# Altium project GPS-RCB-F9T.PrjPcb
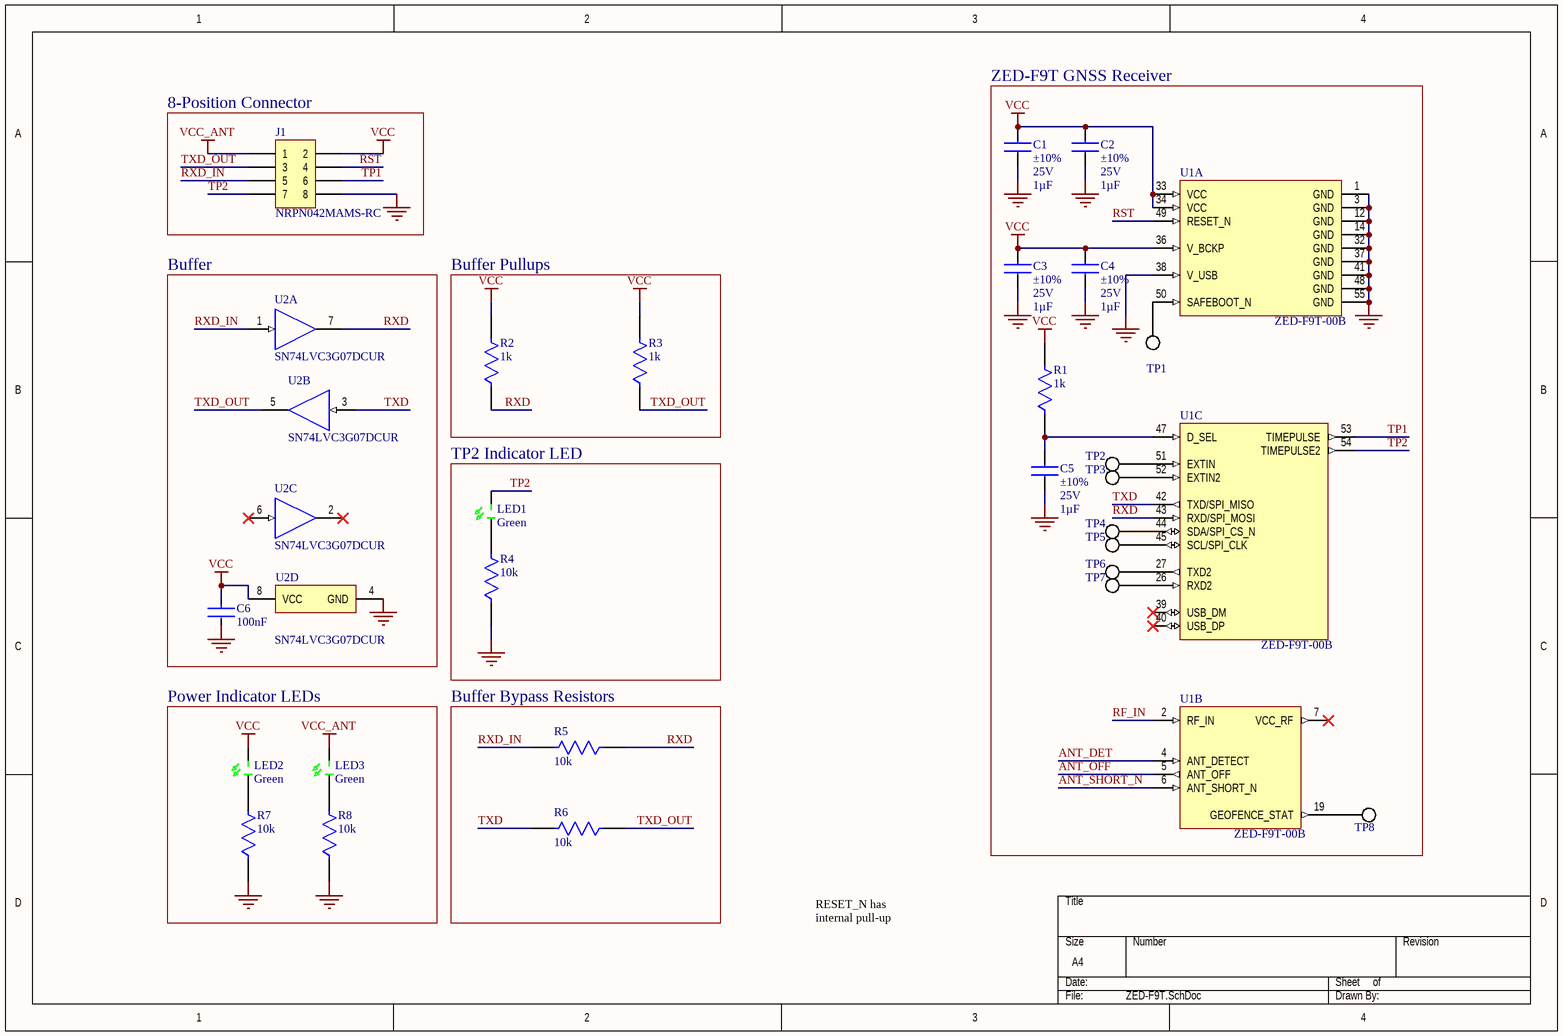
[diagram p0: ZED-F9T.SchDoc]
revision: rev.1.0; TENSH: ТЕНШ.468157.03.00.000; company: SHIWA NETWORK
1 sheet, 28 parts. Net scope: global (net labels, ports and power ports of the same name join across sheets).
Board file: GPS-RCB-F9T.PcbDoc

## Sheet ZED-F9T.SchDoc
size A4; sch_PageDescription: sch_PageDescription; sch_PageTitle: sch_PageTitle; Organization: ORGANIZATION; Address1: ADDRESS 1; Address2: ADDRESS 2; Address3: ADDRESS 3; Address4: ADDRESS 4; Revision: -; SheetNumber: 2; SheetTotal: 3; ENG_APP_DATE: --/--/--; DSN_APP_DATE: --/--/--; CHK_APP_DATE: --/--/--; SPICEModelCachePCDZUYPJ: <root> / <DocumentId>PCDZUYPJ</DocumentId> / <CacheFrame Number="0"> / <Model Name="umk105bj104_v-f" Kind="CKT"> / <Text>* UMK105BJ104_V-F     SPICE MODEL  ( General Type ) / *-------------------------------------------------------------------------------------------------------- / * Model Generated by TAIYO YUDEN Corporation (http://www.ty-top.com) / * Version 1.0 / * TAIYO YUDEN Control No. 170508_120810 / * Copyright(c) 2012 TAIYO YUDEN CO.,LTD. All Rights Reserved. / *-------------------------------------------------------------------------------------------------------- / * / * Products Name : Multilayer Ceramic Capacitors / * / * Characteristics : / *     Capacitance : 0.1 uF , Rated Voltage : 50V , TCC : X5R / *     Case Size : 1.0 x 0.5 / 0.039 x 0.02 [mm/inch] , Thickness : 0.5 / 0.02 [mm/inch] / *     (Conditions: Temperature = 25 degC , DC Bias Current/Voltage = 0A / 0V) / * / * Frequency Range : 40Hz - 3GHz / * / * External Node Assignments : / * / *  1  o---| |---o  2 / * / *-------------------------------------------------------------------------------------------------------- / .SubCkt UMK105BJ104_V-F 1 2 / **************************** / C0 1 110 0.068998u / Cm 1 101 0.01292u / C1 101 102 0.041907u / Rc1 101 102 25.432k / C2 102 103 0.021417u / Rc2 102 103 1.1926k / C3 103 110 0.016759u / Rc3 103 110 12.415 / C2m 1 301 0.022631u / C21 301 302 0.1608u / Rc21 301 302 202.11k / C22 302 303 0.054305u / Rc22 302 303 87.274k / C23 303 304 0.14296u / Rc23 303 304 7.7387k / C24 304 305 0.08092u / Rc24 304 305 2.9339k / C25 305 306 0.04951u / Rc25 305 306 2.1733k / C26 306 307 0.043691u / Rc26 306 307 191.91 / C27 307 308 0.016759u / Rc27 307 308 147.23 / C28 308 309 5027.4p / Rc28 308 309 97.746 / C29 309 110 570.66p / Rc29 309 110 12.365 / Rp0 1 110 5G / L0 110 120 0.23341n / Lm 120 130 0.14222n / L1 120 121 0.036554n / RL1 121 130 1.698 / L2 120 122 0.11188n / RL2 122 130 0.33926 / L3 120 123 1.1401n / RL3 123 130 1.655 / CR 120 124 0.028892u / LR 124 125 0.10347n / RR 125 130 0.14446 / CL 130 140 2.048p / LL 130 140 0.1545n / RL 130 140 189.66 / Rs 140 2 26.069m / **************************** / .ends UMK105BJ104_V-F</Text> / </Model> / </CacheFrame> / </root>

### Parts
C1  Tolerance: ±10%  Voltage Rating: 25V  Capacitance: 1µF  [CAPC1005X055N]  (hidden comment: Murata_GRM155R61E105KA12D)
C2  Tolerance: ±10%  Voltage Rating: 25V  Capacitance: 1µF  [CAPC1005X055N]  (hidden comment: Murata_GRM155R61E105KA12D)
C3  Tolerance: ±10%  Voltage Rating: 25V  Capacitance: 1µF  [CAPC1005X055N]  (hidden comment: Murata_GRM155R61E105KA12D)
C4  Tolerance: ±10%  Voltage Rating: 25V  Capacitance: 1µF  [CAPC1005X055N]  (hidden comment: Murata_GRM155R61E105KA12D)
C5  Tolerance: ±10%  Voltage Rating: 25V  Capacitance: 1µF  [CAPC1005X055N]  (hidden comment: Murata_GRM155R61E105KA12D)
C6  100nF  [FP-0402-L_1_0_0_05-W_0_5-IPC_B]
J1  NRPN042MAMS-RC  [NRPN042MAMS-RC]
LED1  Color: Green  [LEDS160X80X110-2N_LXFM0603-GR]  (hidden comment: Lumex_SML-LXFM0603SUGCTR)
LED2  Color: Green  [LEDS160X80X110-2N_LXFM0603-GR]  (hidden comment: Lumex_SML-LXFM0603SUGCTR)
LED3  Color: Green  [LEDS160X80X110-2N_LXFM0603-GR]  (hidden comment: Lumex_SML-LXFM0603SUGCTR)
R1  1k  [FP-RMCF0402-MFG]
R2  1k  [FP-RMCF0402-MFG]
R3  1k  [FP-RMCF0402-MFG]
R4  10k  [FP-RMCF0402-IPC_C]
R5  10k  [FP-RMCF0402-IPC_C]
R6  10k  [FP-RMCF0402-IPC_C]
R7  10k  [FP-RMCF0402-IPC_C]
R8  10k  [FP-RMCF0402-IPC_C]
TP1  SMT_100DIA  [TP001V_SMT_100DIA]  (value not drawn)  (no BOM)
TP2  SMT_100DIA  [TP001V_SMT_100DIA]  (value not drawn)  (no BOM)
TP3  SMT_100DIA  [TP001V_SMT_100DIA]  (value not drawn)  (no BOM)
TP4  SMT_100DIA  [TP001V_SMT_100DIA]  (value not drawn)  (no BOM)
TP5  SMT_100DIA  [TP001V_SMT_100DIA]  (value not drawn)  (no BOM)
TP6  SMT_100DIA  [TP001V_SMT_100DIA]  (value not drawn)  (no BOM)
TP7  SMT_100DIA  [TP001V_SMT_100DIA]  (value not drawn)  (no BOM)
TP8  SMT_100DIA  [TP001V_SMT_100DIA]  (value not drawn)  (no BOM)
U1  ZED-F9T-00B  [GPS_ZED-F9T]  (parts A,B,C of 3)
U2  SN74LVC3G07DCUR  [DCU0008A_N]  (parts A,B,C,D of 4)

### Blocks framed on the sheet
ZED-F9T GNSS Receiver: C1-C5 R1 TP1-TP8 U1
8-Position Connector: J1
Buffer: C6 U2
Buffer Pullups: R2 R3
TP2 Indicator LED: LED1 R4
Power Indicator LEDs: LED2 LED3 R7 R8
Buffer Bypass Resistors: R5 R6

### Nets
GND: C1.2 C2.2 C3.2 C4.2 C5.2 C6.2 J1.8 R4.1 R7.1 R8.1 U1.1(GND) U1.3(GND) U1.12(GND) U1.14(GND) U1.32(GND) U1.37(GND) U1.38(V_USB) U1.41(GND) U1.48(GND) U1.55(GND) U2.4(GND)
VCC: C1.1 C2.1 C3.1 C4.1 C6.1 J1.2 LED2.A(Anode) R1.2 R2.2 R3.2 U1.33(VCC) U1.34(VCC) U1.36(V_BCKP) U2.8(VCC)
VCC_ANT: J1.1 LED3.A(Anode)
ANT_DET: U1.4(ANT_DETECT)
ANT_OFF: U1.5(ANT_OFF)
ANT_SHORT_N: U1.6(ANT_SHORT_N)
RF_IN: U1.2(RF_IN)
RST: J1.4 U1.49(RESET_N)
RXD: R2.1 R5.1 U1.43(RXD/SPI_MOSI) U2.7(1Y)
RXD_IN: J1.5 R5.2 U2.1(1A)
TP1: J1.6 U1.53(TIMEPULSE)
TP2: J1.7 LED1.A(Anode) U1.54(TIMEPULSE2)
TXD: R6.2 U1.42(TXD/SPI_MISO) U2.3(2A)
TXD_OUT: J1.3 R3.1 R6.1 U2.5(2Y)
NetC5_1: C5.1 R1.1 U1.47(D_SEL)
NetLED1_K: LED1.K(Cathode) R4.2
NetLED2_K: LED2.K(Cathode) R7.2
NetLED3_K: LED3.K(Cathode) R8.2
NetTP1_1: TP1.1 U1.50(SAFEBOOT_N)
NetTP2_1: TP2.1 U1.51(EXTIN)
NetTP3_1: TP3.1 U1.52(EXTIN2)
NetTP4_1: TP4.1 U1.44(SDA/SPI_CS_N)
NetTP5_1: TP5.1 U1.45(SCL/SPI_CLK)
NetTP6_1: TP6.1 U1.27(TXD2)
NetTP7_1: TP7.1 U1.26(RXD2)
NetTP8_1: TP8.1 U1.19(GEOFENCE_STAT)

Not connected (* = marked no-connect by the designer): U1 7(VCC_RF)* 39(USB_DM)* 40(USB_DP)*; U2 2(3Y)* 6(3A)*

### Notes on the sheet
- RESET_N has internal pull-up
- DWG. NO.
- REV.
- SHT.
- THIS DOCUMENT AND THE DATA DISCLOSED HEREIN OR HEREWITH IS THE PROPERTY OF ALTIUM LIMITED AND MAY BE FREELY DISTRIBUTED IN WHOLE. NO RIGHTS ARE RESERVED OR EXPRESS OR IMPLIED WARANTEE GIVEN.
- REVISION
- DESCRIPTION
- DATE
- APPROVED
- ENG:
- APPROVALS
- PROJECT
- DSN:
- CHK:
- REFERENCE DOCUMENTS
- PROJECT REVISION:
- TITLE
- DOCUMENT REVISION:
- DESIGN ITEM:
- BOM:
- FAB DWG:
- PCB DWG:
- ASSY DWG:
- SCALE:
- SIZE
- B
- CAGE CODE
- FILE NAME
- DWG NO.
- SHEET
- OF
- REV

### Library data of the parts
C1-C5 = CAP-CMP-00365-3: CAP, CER, X5R, 1UF, 10%, 25V, 0402, 0.55MM T; Manufacturer: Murata; Internal Part Number: 825-00099-00; Polarization: Non-polar; Datasheet URL: https://www.digikey.com/en/products/detail/murata-electronics/GRM155R61E105KA12D/4905139?s=N4IgTCBcDaIOICUCyBGArGhA2FBRFADGgNICCKYAIiALoC%2BQA; RoHS: Yes; Mounting Type: Surface Mount, MLCC; Max Operating Temperature: 85°C; Category: Ceramic Capacitors; Height: 0.022" (0.55mm); Supplier 1: Digikey; Manufacturer Part Number: GRM155R61E105KA12D; Temperature Coefficient: X5R; Min Operating Temperature: -55°C; Case/Package: 0402 (1005 Metric); Size / Dimension: 0.039" L x 0.020" W (1.00mm x 0.50mm); Composition: Ceramic; Supplier Part Number 1: 490-10017-1-ND; Series: GRM155R61E; Applications: General Purpose
C6 = CMP-14477-000330-2: None; Voltage Rating (DC): 50V; Dielectric: X5R; Tolerance: 10%; RoHS Compliant: Yes; Termination: SMD/SMT; Packaging: Tape and Reel; Capacitance: 100nF; Height: 0.5mm; Halogen Free: Halogen Free; Case Code (Metric): 1005; Width: 0.02inch; Max Operating Temperature: 85°C; Voltage Rating: 50V; Min Operating Temperature: -55°C; Package Quantity: 10000; Case/Package: 0402; Case Code (Imperial): 0402; Length: 0.039inch; Thickness: 0.022inch; Mount: Surface Mount
J1 = NRPN042MAMS-RC: Dual Row 8 Position 2 mm Pitch Surface Mount Header; Manufacturer: Sullins; Number of Positions: 8; Connector Type: Male Pin; Pitch: 0.079inch; Supplier 1: Digi-Key; Manufacturer Part Number: NRPN042MAMS-RC; RoHS: Yes; Category: Connectors; Stock 1: 10801; Pricing 1: 1=0.76000, 76=0.60237, 152=0.57618, 456=0.47143, 988=0.41904, 4940=0.37830 (USD); Mount: Surface Mount; Color: Black; Contact Plating: Gold; Contact Material: Brass; Housing Material: Nylon; Package Quantity: 1000; Number of Rows: 2; Packaging: Bulk; Termination: Solder; Contact Type: Male Pin; Length: 8mm; Width: 4mm; Height: 1.5mm; Row Spacing: 0.079inch; Contact Mating Length: 0.141inch; Lead Free: Lead Free; RoHS Compliant: Yes; ComponentLink1URL: https://datasheet.ciiva.com/711/nrpnxx2mamx-rc-10495-d-711179.pdf?src-supplier=Digi-Key; ComponentLink1Description: https://datasheet.ciiva.com/711/nrpnxx2mamx-rc-10495-d-711179.pdf?src-supplier=Digi-Key; Supplier Part Number 1: S6009-04-ND
LED1-LED3 = LED-CMP-00021-2: LED, GREEN, 574NM, 20MA, 20MCD MIN, 2.5VF MAX, 0603, 1.10MM T; Internal Part Number: 838-00422-00; Manufacturer: Lumex Opto/Components Inc.; Lens Transparency: Clear; Millicandela Rating: 50mcd; Voltage - Forward (Vf) (Typ): 2.2V; Configuration: Independent; Viewing Angle: 120°; Lens Size: 1.20mm x 0.80mm; Lens Style: Rectangle with Flat Top; Size / Dimension: 1.60mm L x 0.80mm W; Max Operating Temperature: 85°C; Min Operating Temperature: -40°C; Category: LED Indication - Discrete; Lens Color: Green; Case/Package: 0603 (1608 Metric); Current - Test: 20mA; Wavelength - Peak: 574nm; Mounting Type: Surface Mount; RoHS: Yes; Height (Max): 1.10mm; Supplier 1: Digikey; Datasheet URL: https://www.digikey.com/en/products/detail/lumex-opto-components-inc/SML-LXFM0603SUGCTR/7364547?s=N4IgTCBcDaIMoFkAyBaJANAYggDANhwGY4BVAcQGEAVAJRAF0BfIA; Supplier Part Number 1: 67-2320-1-ND; Manufacturer Part Number: SML-LXFM0603SUGCTR
R1-R3 = CMP-26527-000026-1: 1kΩ ±1% 0.063W 0402 Thick Film Chip Resistor AEC-Q200 compliant; Resistance: 1kR; Temperature Coefficient: 100ppm/°C; Power Rating: 63mW; Length: 1mm; RoHS Compliant: Yes; Construction: Rectangular; Height: 0.016inch; Size Code: 0402; Lead Free: Lead Free; Radiation Hardening: No; Tolerance: 1%; Width: 0.02inch; Military Standard: Not; Resistor Type: Thick Film; Number of Terminations: 2; Min Operating Temperature: -55°C; Max Operating Temperature: 155°C; Depth: 0.5mm; Features: Automotive AEC-Q200; Packaging: Tape and Reel; Case Code (Metric): 1005; Mount: Surface Mount; Contact Plating: Tin; Max Power Dissipation: 63mW; Case/Package: 0402; Case Code (Imperial): 0402; Series: RMCF
R4-R8 = CMP-26527-000128-1: 10kΩ ±1% 0.063W 0402 Thick Film Chip Resistor AEC-Q200 compliant; Temperature Coefficient: 100ppm/°C; Power Rating: 62.5mW; Resistance: 10kR; Max Power Dissipation: 63mW; Width: 0.02inch; Case/Package: 0402; Depth: 0.5mm; Resistor Type: Thick Film; Series: RMCF; Length: 1mm; Contact Plating: Tin; Tolerance: 1%; Number of Terminations: 2; Height: 0.016inch; Military Standard: Not; Case Code (Imperial): 0402; Size Code: 0402; Construction: Rectangular; Radiation Hardening: No; RoHS Compliant: Yes; Case Code (Metric): 1005; Packaging: Tape and Reel; Lead Free: Lead Free; Min Operating Temperature: -55°C; Max Operating Temperature: 155°C; Mount: Surface Mount; Features: Automotive AEC-Q200
TP1-TP8 = TPS-CMP-00004-3: TEST POINT, PC, SMT, 1.00MM DIA; Type: PC Test Point, Surface Mount; Size / Dimension: 1.00mm Dia Pad; Category: Test Points; Mounting Type: 1.00mm Dia Pad
U1 = GPS_ZED-F9T: Multi-band GNSS Receiver with Nanosecond-level Timing Accuracy; Manufacturer: u-blox; Interface: I2C,SPI,USB,UART; Sensitivity: -166dBm; Supplier 1: Digi-Key; Manufacturer Part Number: ZED-F9T-00B; RoHS: Yes; Category: RF Receivers, Transceivers; Stock 1: 826; Pricing 1: 1=199.00000, 10=198.80000, 50=180.89020 (USD); Case/Package: SMD/SMT; Min Operating Temperature: -40°C; Max Operating Temperature: 85°C; Packaging: Tape and Reel; ComponentLink1URL: https://www.u-blox.com/sites/default/files/ZED-F9T_ProductSummary_%28UBX-18011626%29.pdf?src-supplier=Digi-Key; ComponentLink1Description: https://www.u-blox.com/sites/default/files/ZED-F9T_ProductSummary_%28UBX-18011626%29.pdf?src-supplier=Digi-Key; Supplier Part Number 1: 672-1197-1-ND
U2 = CMP-0859-00615-3: Triple Buffer/Driver With Open-Drain Output, DCU0008A, LARGE T&R; Manufacturer: Texas Instruments; VCC(Max)(V): 5.5; Sub-Family: Non-Inverting Buffer/Driver; Logic: True; tpd @ Nom Voltage(Max)(ns): 8.3,4.8,4.2,3.4; Output Type: CMOS; F @ Nom Voltage(Max)(Mhz): 150; Technology Family: LVC; ICC @ Nom Voltage(Max)(mA): 0.01; Voltage(Nom)(V): 1.8,2.5,3.3,5; Schmitt Trigger: No; VCC(Min)(V): 1.65; Bits(#): 3; Input Type: CMOS/TTL; Rating: Catalog; Output Drive (IOL/IOH)(Max)(mA): 32/-32; Generic Part Number: SN74LVC3G07; PackageReference: DCU0008A; 3-State Output: No; DatasheetVersion: SCES365K; Operating Temperature Range(C): -40 to 125,-40 to 85

## Assembly variants
release: not fitted R5 R6